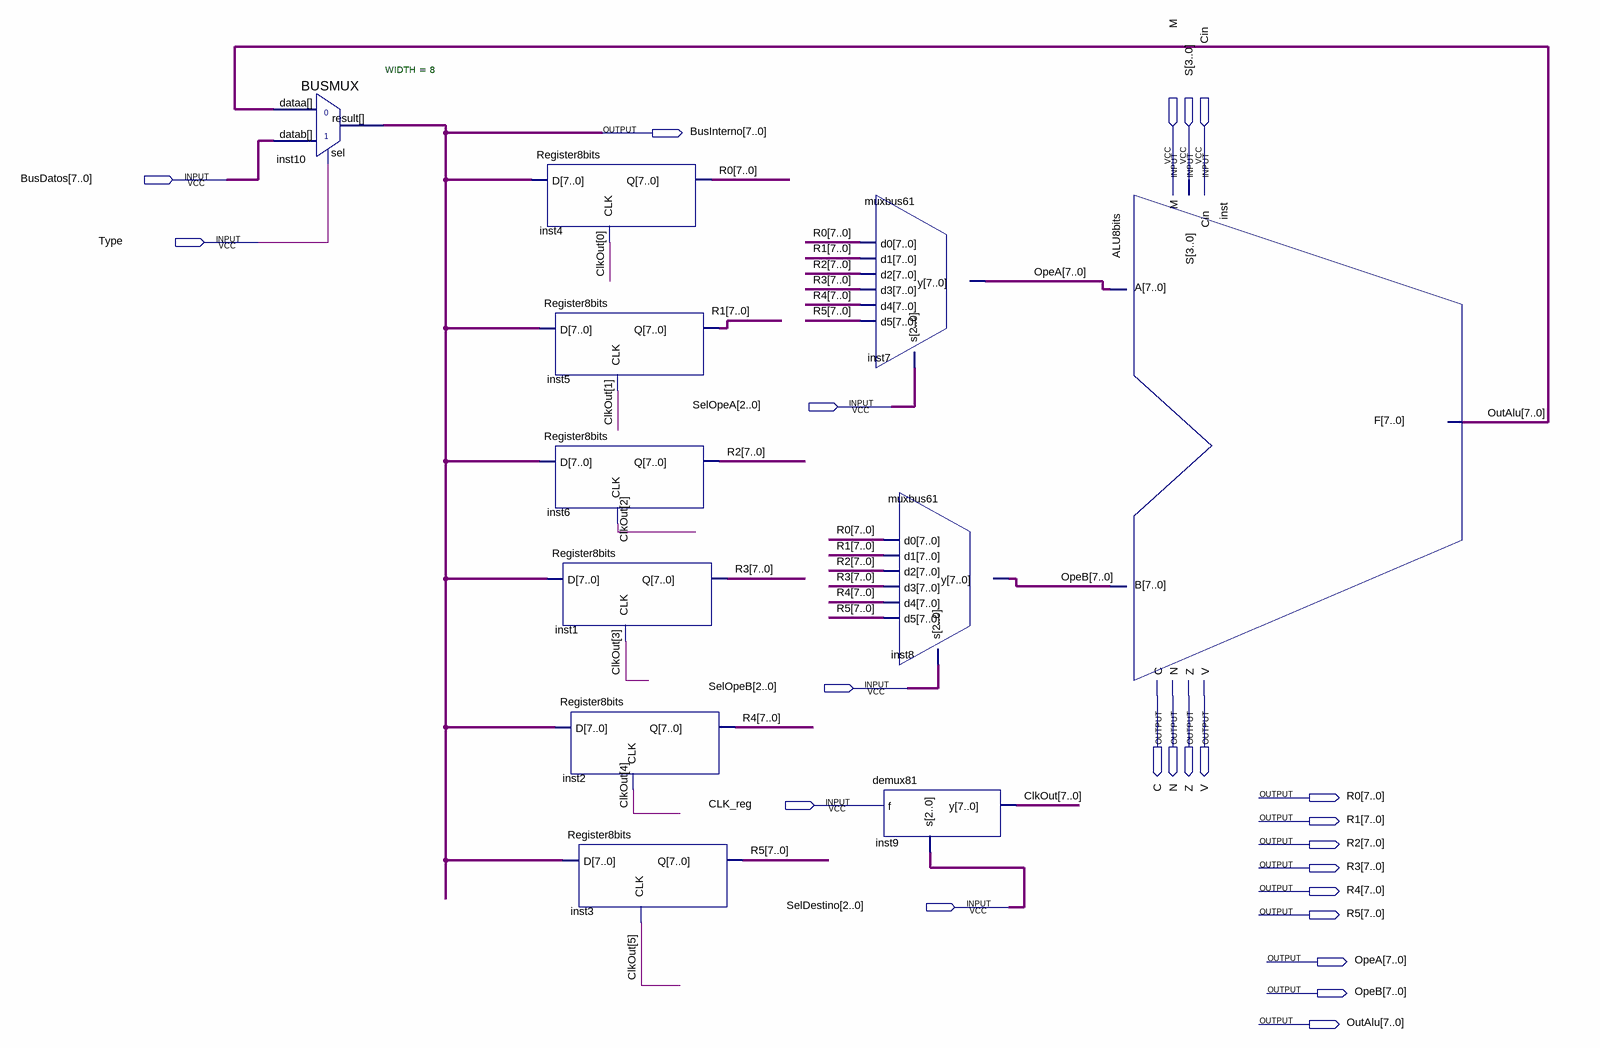
[diagram p0: schematic sheet]
// Quartus schematic CPU8bits.bdf as structural Verilog: 11 symbols, 23 pins
module CPU8bits (
  input  [7:0] BusDatos,
  input  M,
  input  [3:0] S,
  input  Cin,
  input  Type,
  input  [2:0] SelOpeA,
  input  [2:0] SelOpeB,
  input  CLK_reg,
  input  [2:0] SelDestino,
  output [7:0] BusInterno,
  output C,
  output N,
  output Z,
  output V,
  output [7:0] R0,
  output [7:0] R1,
  output [7:0] R2,
  output [7:0] R3,
  output [7:0] R4,
  output [7:0] R5,
  output [7:0] OpeA,
  output [7:0] OpeB,
  output [7:0] OutAlu
);

  wire [7:0] ClkOut;

  BUSMUX #(.WIDTH(8)) inst10 (.datab(BusDatos), .sel(Type), .dataa(OutAlu), .result(BusInterno));
  Register8bits inst4 (.D(BusInterno), .CLK(ClkOut[0]), .Q(R0));
  Register8bits inst5 (.D(BusInterno), .CLK(ClkOut[1]), .Q(R1));
  Register8bits inst6 (.D(BusInterno), .CLK(ClkOut[2]), .Q(R2));
  Register8bits inst1 (.D(BusInterno), .CLK(ClkOut[3]), .Q(R3));
  Register8bits inst2 (.D(BusInterno), .CLK(ClkOut[4]), .Q(R4));
  Register8bits inst3 (.D(BusInterno), .CLK(ClkOut[5]), .Q(R5));
  muxbus61 inst7 (.s(SelOpeA), .d0(R0), .d1(R1), .d2(R2), .d3(R3), .d4(R4), .d5(R5), .y(OpeA));
  muxbus61 inst8 (.s(SelOpeB), .d0(R0), .d1(R1), .d2(R2), .d3(R3), .d4(R4), .d5(R5), .y(OpeB));
  demux81 inst9 (.f(CLK_reg), .s(SelDestino), .y(ClkOut));
  ALU8bits inst (.A(OpeA), .B(OpeB), .M(M), .S(S), .Cin(Cin), .F(OutAlu), .C(C), .N(N), .Z(Z), .V(V));
endmodule
